# EasyEDA Pro project DS3 CONTROLLER R.epro

# Schematic Schematic1
Create Date: 2026-04-04; Page Name: P1; Project Name: DSBOARD3; Schematic Name: Schematic1; Update Date: 2026-04-05; Company: EasyEDA.com; Page Size: A4; Version: V1.0
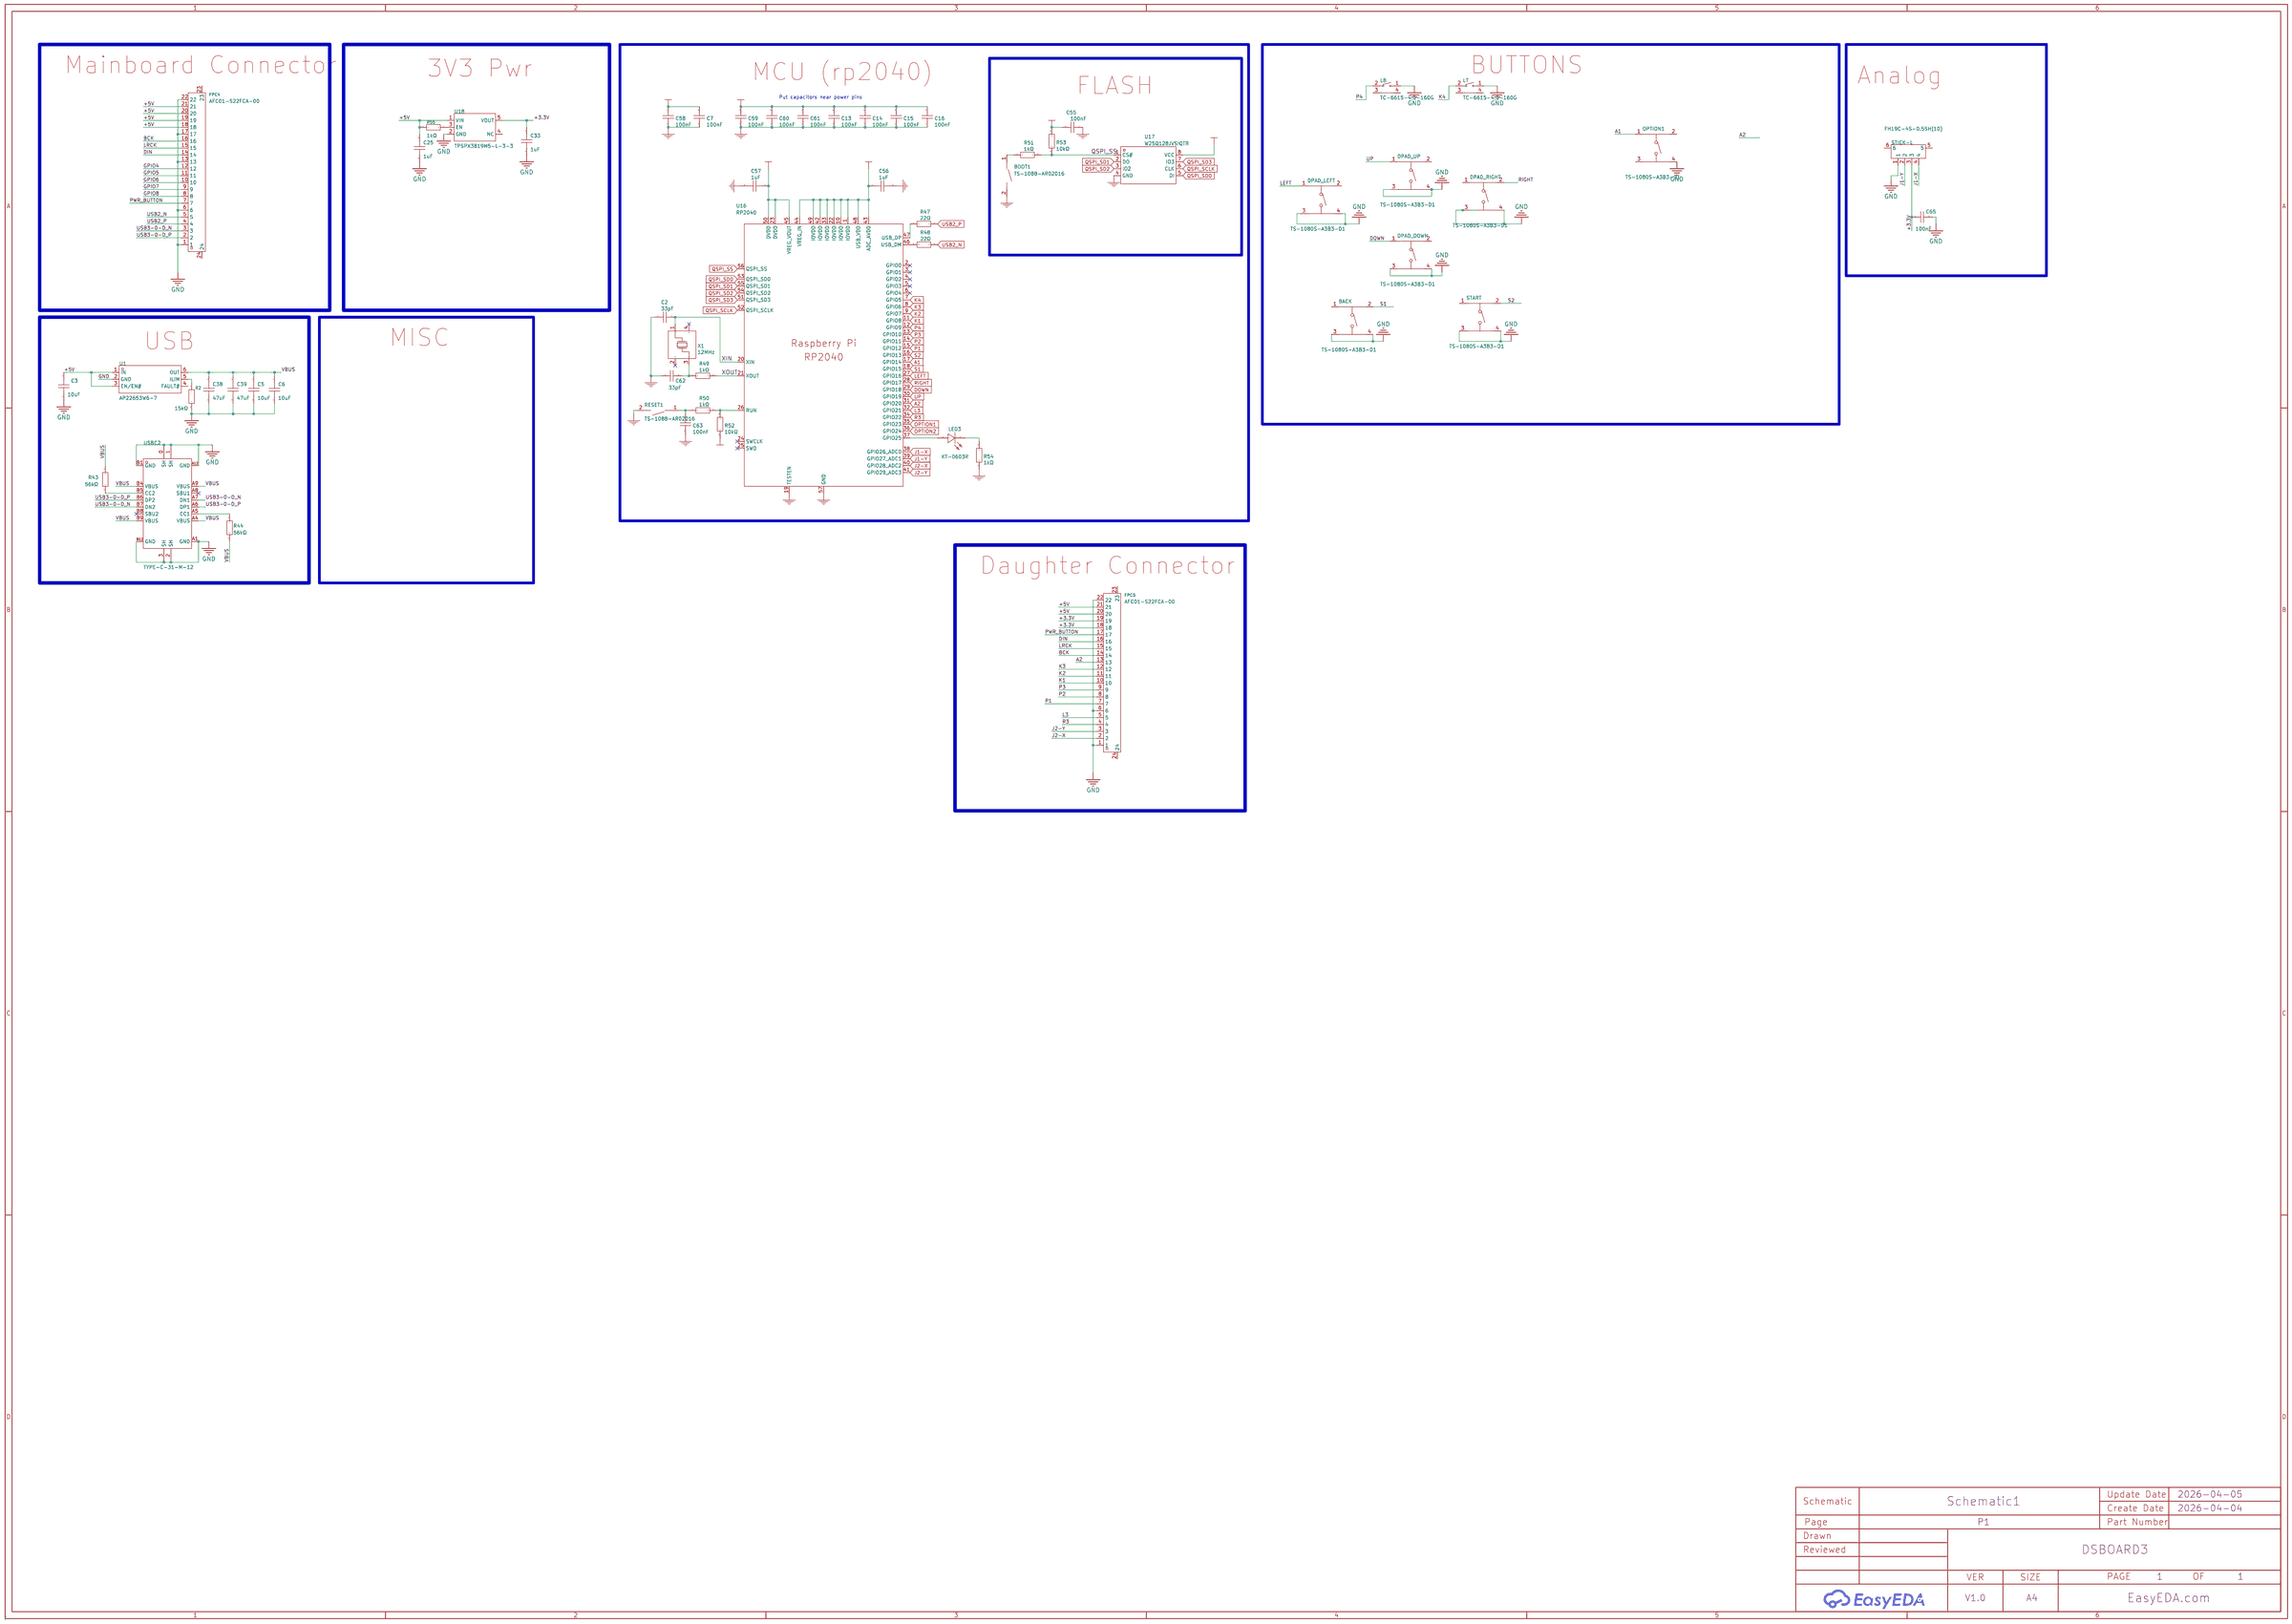
[diagram p0: schematic sheet]

## Parts
BACK  TS-1080S-A3B3-D1  [KEY-SMD_4P-L6.4-W6.0-P4.50-LS8.4]
BOOT1  TS-1088-AR02016  [SW-SMD_L3.9-W3.0-P4.45]
C2  33pF  [C0402]
C3  10uF  [C0805]
C5  10uF  [C0805]
C6  10uF  [C0805]
C7  100nF  [C0402]
C13  100nF  [C0402]
C14  100nF  [C0402]
C15  100nF  [C0402]
C16  100nF  [C0402]
C25  1uF  [C0603]
C33  1uF  [C0603]
C38  47uF  [C1206]
C39  47uF  [C1206]
C55  100nF  [C0402]
C56  1uF  [C0402]
C57  1uF  [C0402]
C58  100nF  [C0402]
C59  100nF  [C0402]
C60  100nF  [C0402]
C61  100nF  [C0402]
C62  33pF  [C0402]
C63  100nF  [C0402]
C65  100nF  [c0402]
DPAD_DOWN  TS-1080S-A3B3-D1  [KEY-SMD_4P-L6.4-W6.0-P4.50-LS8.4]
DPAD_LEFT  TS-1080S-A3B3-D1  [KEY-SMD_4P-L6.4-W6.0-P4.50-LS8.4]
DPAD_RIGHT  TS-1080S-A3B3-D1  [KEY-SMD_4P-L6.4-W6.0-P4.50-LS8.4]
DPAD_UP  TS-1080S-A3B3-D1  [KEY-SMD_4P-L6.4-W6.0-P4.50-LS8.4]
FPC4  AFC01-S22FCA-00  [FPC-SMD_P0.5-22P_FGS-XJ-H2.0]
FPC5  AFC01-S22FCA-00  [FPC-SMD_P0.5-22P_FGS-XJ-H2.0]
LB  TC-6615-4.5-160G  [KEY-TH_TC-6615-4.5-160G]
LED3  KT-0603R  [LED0603-RD]
LT  TC-6615-4.5-160G  [KEY-TH_TC-6615-4.5-160G]
OPTION1  TS-1080S-A3B3-D1  [KEY-SMD_4P-L6.4-W6.0-P4.50-LS8.4]
R2  15kΩ  [R0402]
R43  56kΩ  [R0402]
R44  56kΩ  [R0402]
R47  22Ω  [R0402]
R48  22Ω  [R0402]
R49  1kΩ  [R0402]
R50  1kΩ  [R0402]
R51  1kΩ  [R0402]
R52  10kΩ  [R0402]
R53  10kΩ  [R0402]
R54  1kΩ  [R0402]
R55  1kΩ  [R0402]
RESET1  TS-1088-AR02016  [SW-SMD_L3.9-W3.0-P4.45]
START  TS-1080S-A3B3-D1  [KEY-SMD_4P-L6.4-W6.0-P4.50-LS8.4]
STICK-L  FH19C-4S-0.5SH(10)  [FPC-SMD_FH19C-4S-0.5SH]
U1  AP22653W6-7  [SOT-23-6_L2.9-W1.6-P0.95-LS2.8-BR]
U16  RP2040  [LQFN-56_L7.0-W7.0-P0.4-EP]
U17  W25Q128JVSIQTR  [SOIC-8_L5.3-W5.3-P1.27-LS8.0-BL]
U18  TPSPX3819M5-L-3-3  [SOT-23-5_L3.0-W1.6-P0.95-LS2.8-BR]
USBC2  TYPE-C-31-M-12  [USB-C_SMD-TYPE-C-31-M-12]
X1  12MHz  [OSC-SMD_4P-L3.2-W2.5-BL]

## Library data of the parts
BACK DPAD_DOWN DPAD_LEFT DPAD_RIGHT DPAD_UP OPTION1 START = TS-1080S-A3B3-D1: Circuit:SPST Actuator Style:Round Button Operating Force:250gf Mounting Type:Standing paste Length:6.4mm Width:6mm Switch Height:3.1mm With Lamp:- Life:-; LCSC Part Name: 停产 6.4*6*3.1mm 立贴 轻触开关; Supplier Part: C499295; Manufacturer: Yuandi(元迪); Supplier Footprint: SMD,6.2x6.2mm; JLCPCB Part Class: Extended Part; Datasheet: https://atta.szlcsc.com/upload/public/pdf/source/20200318/C499299_4F5ACF0CDEE8DE9CCEB2FD2261C6EB2B.pdf; Supplier: LCSC; Circuit: SPST; Actuator Style: Round Button; Operating Force: 250gf; Mounting Type: Standing paste; Length: 6.4mm; Width: 6mm; Switch Height: 3.1mm; Mounting Style: Brick nogging; Switch Length: 6mm; Switch Width: 6mm; Contact Current: 50mA; Voltage Rating (DC): 12V; Insulation Resistance: 100MΩ; Mechanical Life: 10万次; Operating Temperature: -25℃~+85℃
BOOT1 RESET1 = TS-1088-AR02016: Circuit:SPST Actuator Style:Round Button Operating Force:160gf Mounting Style:Brick nogging Switch Length:4mm Switch Width:3mm Switch Height:2mm Strike Gundam:不带 Contact Current:50mA Voltage Rating (DC):12V Insulation Resistance:100MΩ Actuator/Cap Color:B; LCSC Part Name: 4*3*2mm 立贴 轻触开关; Supplier Part: C720477; Manufacturer: XUNPU(讯普); Supplier Footprint: SMD; JLCPCB Part Class: Basic Part; Datasheet: https://atta.szlcsc.com/upload/public/pdf/source/20200810/C720475_60D09DD6C54279ADDB2DC25100F1CC11.pdf; Supplier: LCSC; Circuit: SPST; Actuator Style: Round Button; Operating Force: 160gf; Mounting Style: Brick nogging; Switch Length: 4mm; Switch Width: 3mm; Switch Height: 2mm; Strike Gundam: 不带; Contact Current: 50mA; Voltage Rating (DC): 12V; Insulation Resistance: 100MΩ; Actuator/Cap Color: Black; Pin Style: SMDSplicing; Mechanical Life: 10万次; Operating Temperature: -30℃~+80℃
C2 C62 = 0402CG330J500NT: Supplier: LCSC; Manufacturer: FH(风华); Supplier Part: C1562; JLCPCB Part Class: Basic Part
C3 C5 C6 = CL21A106KAYNNNE_C15850: Capacitance: Tolerance:±10% Tolerance:±10% Voltage Rated: Temperature Coefficient:; LCSC Part Name: 10uF ±10% 25V; Supplier Part: C15850; Manufacturer: SAMSUNG(三星); Manufacturer Part: CL21A106KAYNNNE; Supplier Footprint: 0805; JLCPCB Part Class: Basic Part; Datasheet: https://atta.szlcsc.com/upload/public/pdf/source/20160218/1457707763339.pdf; Supplier: LCSC; Tolerance: ±10%
C7 C13-C16 C55 C58-C61 C63 C65 = CL05B104KO5NNNC: Supplier: LCSC; Manufacturer: SAMSUNG(三星); Supplier Part: C1525; JLCPCB Part Class: Basic Part
C25 C33 = CL10A105KB8NNNC: Capacitance: Tolerance:±10% Tolerance:±10% Voltage Rated: Temperature Coefficient:; LCSC Part Name: 1uF ±10% 50V; Supplier Part: C15849; Manufacturer: SAMSUNG(三星); Supplier Footprint: 0603; JLCPCB Part Class: Basic Part; Datasheet: https://atta.szlcsc.com/upload/public/pdf/source/20160218/1457707763339.pdf; Supplier: LCSC; Tolerance: ±10%
C38 C39 = CL31A476MPHNNNE: Capacitance: Tolerance:±20% Tolerance:±20% Voltage Rated: Temperature Coefficient:; LCSC Part Name: 47uF ±20% 10V; Supplier Part: C96123; Manufacturer: SAMSUNG(三星); Supplier Footprint: 1206; JLCPCB Part Class: Basic Part; Datasheet: https://atta.szlcsc.com/upload/public/pdf/source/20160218/1457707763339.pdf; Supplier: LCSC; Tolerance: ±20%
C56 C57 = CL05A105KA5NQNC: Supplier: LCSC; Manufacturer: SAMSUNG(三星); Supplier Part: C52923; JLCPCB Part Class: Basic Part
FPC4 FPC5 = AFC01-S22FCA-00: Locking Feature:Clamshell Contact Type:Bottom Contact Number of Contacts:22P Pitch:0.5mm Mounting Type:卧贴 FFC, FCB Thickness:0.3mm FFC, FCB Thickness:0.3mm Height Above Board:2mm; LCSC Part Name: 间距:0.5mm P数:22P 翻盖式 下接; Supplier Part: C262668; Manufacturer: JS(钜硕电子); Supplier Footprint: SMD,P=0.5mm,卧贴; JLCPCB Part Class: Extended Part; Datasheet: https://atta.szlcsc.com/upload/public/pdf/source/20190816/C413942_2A72D1AC756EAE17EEDF756A339D4500.pdf; Supplier: LCSC; Locking Feature: Clamshell; Contact Type: Bottom Contact; Number of Contacts: 22P; Pitch: 0.5mm; Mounting Type: 卧贴; FFC, FCB Thickness: 0.3mm; Height Above Board: 2mm; Contact Material: Phosphor bronze; Contact Plating: Gold; Operating Temperature Range: -40℃~+85℃
LB LT = TC-6615-4.5-160G: Circuit:SPST Actuator Style:Round Button Operating Force:160gf Mounting Style:Horizontal Plug Switch Length:6mm Switch Width:6mm Switch Height:4.5mm Strike Gundam:With bracket Contact Current:50mA Voltage Rating (AC):- Voltage Rating (DC):12V Insulation R; LCSC Part Name: 6*6*4.5mm 卧插 轻触开关; Supplier Part: C6575012; Manufacturer: HCTL(华灿天禄); Supplier Footprint: 插件; JLCPCB Part Class: Extended Part; Datasheet: https://atta.szlcsc.com/upload/public/pdf/source/20230523/20C79B748B4ACB531A66068A8A6BD305.pdf; Supplier: LCSC; Circuit: SPST; Actuator Style: Round Button; Operating Force: 160gf; Mounting Style: Horizontal Plug; Switch Length: 6mm; Switch Width: 6mm; Switch Height: 4.5mm; Strike Gundam: With bracket; Contact Current: 50mA; Voltage Rating (DC): 12V; Insulation Resistance: 100MΩ; Actuator/Cap Color: Black; With Lamp: None; Mechanical Life: 100000 Times; Operating Temperature: -25℃~+85℃
LED3 = KT-0603R: Emitted Color:Red Power Dissipation:- Forward Current:- Dominant Wavelength:- Dominant Wavelength:- Peak Wavelength:- Diode Configuration:- Lens Color:- Color Temperature:- Color Temperature:- Viewing Angle:- Mounting Sytle:- Operating Temperature:-40℃~+8; LCSC Part Name: 0603 红灯 高亮; Supplier Part: C2286; Manufacturer: KENTO; Supplier Footprint: 0603; JLCPCB Part Class: Basic Part; Datasheet: https://atta.szlcsc.com/upload/public/pdf/source/20160616/1466072038404.pdf; Supplier: LCSC; Emitted Color: Red; Operating Temperature: -40℃~+85℃
R2 = 0402WGF1502TCE: Type:Thick Film Resistors Resistance:15kΩ Tolerance:±1% Tolerance:±1% Power(Watts): Overload Voltage (Max): Temperature Coefficient:±100ppm/℃ Temperature Coefficient:±100ppm/℃ Operating Temperature Range:-55℃~+155℃ Operating Temperature Range:-55℃~+155℃; LCSC Part Name: 15kΩ ±1% 62.5mW 厚膜电阻; Supplier Part: C25756; Manufacturer: UNI-ROYAL(厚声); Supplier Footprint: 0402; JLCPCB Part Class: Basic Part; Datasheet: https://atta.szlcsc.com/upload/public/pdf/source/20200306/C422600_1E6D84923E4A46A82E41ADD87F860B5C.pdf; Supplier: LCSC; Type: Thick Film Resistors; Tolerance: ±1%; Temperature Coefficient: ±100ppm/℃; Operating Temperature Range: -55℃~+155℃
R43 R44 = 0402WGF5602TCE: Type:Thick Film Resistors Resistance:56kΩ Tolerance:±1% Tolerance:±1% Power(Watts): Overload Voltage (Max): Temperature Coefficient:±100ppm/℃ Temperature Coefficient:±100ppm/℃ Operating Temperature Range:-55℃~+155℃ Operating Temperature Range:-55℃~+155℃; LCSC Part Name: 56kΩ ±1% 62.5mW 厚膜电阻; Supplier Part: C25796; Manufacturer: UNI-ROYAL(厚声); Supplier Footprint: 0402; JLCPCB Part Class: Extended Part; Datasheet: https://atta.szlcsc.com/upload/public/pdf/source/20200306/C422600_1E6D84923E4A46A82E41ADD87F860B5C.pdf; Supplier: LCSC; Type: Thick Film Resistors; Tolerance: ±1%; Temperature Coefficient: ±100ppm/℃; Operating Temperature Range: -55℃~+155℃
R47 R48 = 0402WGF220JTCE: Supplier: LCSC; Manufacturer: UNI-ROYAL(厚声); Supplier Part: C25092; Resistance: 22; JLCPCB Part Class: Basic Part
R49-R51 R54 = 0402WGF1001TCE: Supplier: LCSC; Manufacturer: UNI-ROYAL(厚声); Supplier Part: C11702; Resistance: 1K; JLCPCB Part Class: Basic Part
R52 R53 = 0402WGF1002TCE: Supplier: LCSC; Manufacturer: UNI-ROYAL(厚声); Supplier Part: C25744; Resistance: 10K; JLCPCB Part Class: Basic Part
R55 = 0402WGF1001TCE: Type:Thick Film Resistors Resistance:1kΩ Tolerance:±1% Tolerance:±1% Power(Watts): Overload Voltage (Max): Temperature Coefficient:±100ppm/℃ Temperature Coefficient:±100ppm/℃ Operating Temperature Range:-55℃~+155℃ Operating Temperature Range:-55℃~+155℃; LCSC Part Name: 1kΩ ±1% 62.5mW 厚膜电阻; Supplier Part: C11702; Manufacturer: UNI-ROYAL(厚声); Supplier Footprint: 0402; JLCPCB Part Class: Basic Part; Datasheet: https://atta.szlcsc.com/upload/public/pdf/source/20200306/C422600_1E6D84923E4A46A82E41ADD87F860B5C.pdf; Supplier: LCSC; Type: Thick Film Resistors; Tolerance: ±1%; Temperature Coefficient: ±100ppm/℃; Operating Temperature Range: -55℃~+155℃
STICK-L = FH19C-4S-0.5SH(10): Locking Feature:Clamshell Contact Type:Bottom Contact Number of Contacts:4P Pitch:0.5mm Mounting Type:卧贴 FFC, FCB Thickness:0.2mm FFC, FCB Thickness:0.2mm Height Above Board:0.88mm Contact Material:Phosphor bronze Contact Plating:Gold Operating Temperatur; LCSC Part Name: 间距:0.5mm P数:4P 翻盖式 下接; Supplier Part: C424650; Manufacturer: HRS(广濑); Supplier Footprint: SMD,P=0.5mm,卧贴; JLCPCB Part Class: Extended Part; Datasheet: https://atta.szlcsc.com/upload/public/pdf/source/20190903/C424652_96088C35DDF9B9746B51C85A1732CDEC.pdf; Supplier: LCSC; Locking Feature: Clamshell; Contact Type: Bottom Contact; Number of Contacts: 4P; Pitch: 0.5mm; Mounting Type: 卧贴; FFC, FCB Thickness: 0.2mm; Height Above Board: 0.88mm; Contact Material: Phosphor bronze; Contact Plating: Gold; Operating Temperature Range: -55℃~+85℃
U1 = AP22653W6-7: Number of Outputs:1 Output Current:2.1A Input Voltage:3V~5.5V Input Voltage:3V~5.5V Resistor On-State:65mΩ Operating Temperature -:-40℃~+85℃ Operating Temperature -:-40℃~+85℃; Supplier Part: C2158037; Manufacturer: DIODES(美台); Supplier Footprint: SOT-26; JLCPCB Part Class: Extended Part; Datasheet: https://atta.szlcsc.com/upload/public/pdf/source/20210630/864BBA6F47FEA2EACA8A2C6E64AF9219.pdf; Supplier: LCSC; Number of Outputs: 1; Output Current: 2.1A; Input Voltage: 3V~5.5V; Resistor On-State: 65mΩ; Operating Temperature	-: -40℃~+85℃
U16 = RP2040: Supplier: LCSC; Supplier Part: C2040; Manufacturer: Raspberry Pi(树莓派); JLCPCB Part Class: Extended Part
U17 = W25Q128JVSIQ: Supplier: LCSC; Manufacturer: WINBOND(华邦); Supplier Part: C97521; JLCPCB Part Class: Basic Part
U18 = TPSPX3819M5-L-3-3: Output Type:Fixed Voltage - Supply:20V Output Voltage:3.3V Output Voltage:3.3V Output Current:500mA Power Supply Rejection Ratio (PSRR):- Operating Temperature:-40℃~+125℃@(Tj) Operating Temperature:-40℃~+125℃@(Tj) Output Configuration:Positive electrode N; Supplier Part: C5370980; Manufacturer: TECH PUBLIC(台舟); Supplier Footprint: SOT-23-5; JLCPCB Part Class: Extended Part; Datasheet: https://atta.szlcsc.com/upload/public/pdf/source/20231102/1CEED3DA25748E8590103A514E6172D9.pdf; Supplier: LCSC; Output Type: Fixed; Voltage - Supply: 20V; Output Voltage: 3.3V; Output Current: 500mA; Operating Temperature: -40℃~+125℃@(Tj); Output Configuration: Positive electrode; Number of Outputs: 1
USBC2 = TYPE-C-31-M-12: Connector Type:Type-C Standard:- Gender:Female Mounting Style:- Number of Contacts:16P Number of Ports:1 Current Rating - Power (Max):5A Operating Temperature Range:- Operating Temperature Range:-; LCSC Part Name: Type-C 母; Supplier Part: C165948; Manufacturer: 韩国韩荣; Supplier Footprint: SMD; JLCPCB Part Class: Extended Part; Datasheet: https://atta.szlcsc.com/upload/public/pdf/source/20220525/466408E853115E789EDB0DDC29077C05.pdf; Supplier: LCSC; Connector Type: Type-C; Gender: Female; Number of Contacts: 16P; Number of Ports: 1; Current Rating - Power (Max): 5A
X1 = X322512MSB4SI: Supplier: LCSC; Manufacturer: YXC; Supplier Part: C9002; JLCPCB Part Class: Basic Part

## Nets
+1V1: C7.2 C57.1 C58.2 U16.23(DVDD) U16.45(VREG_VOUT) U16.50(DVDD)
+3.3V: C13.2 C14.2 C15.2 C16.2 C33.1 C55.2 C56.1 C59.2 C60.2 C61.2 C65.1 FPC5.18 FPC5.19 R52.1 R53.2 STICK-L.3 U16.1(IOVDD) U16.10(IOVDD) U16.22(IOVDD) U16.33(IOVDD) U16.42(IOVDD) U16.43(ADC_AVDD) U16.44(VREG_IN) U16.48(USB_VDD) U16.49(IOVDD) U17.8(VCC) U18.5(VOUT)
+5V: C3.1 C25.1 FPC4.18 FPC4.19 FPC4.20 FPC4.21 FPC5.20 FPC5.21 R55.1 U1.1(IN) U1.3(EN/EN#) U18.1(VIN)
GND: BACK.3 BACK.4 BOOT1.2 C2.1 C3.2 C5.2 C6.2 C7.1 C13.1 C14.1 C15.1 C16.1 C25.2 C33.2 C38.2 C39.2 C55.1 C56.2 C57.2 C58.1 C59.1 C60.1 C61.1 C62.1 C63.1 C65.2 DPAD_DOWN.3 DPAD_DOWN.4 DPAD_LEFT.3 DPAD_LEFT.4 DPAD_RIGHT.3 DPAD_RIGHT.4 DPAD_UP.3 DPAD_UP.4 FPC4.1 FPC4.6 FPC4.13 FPC4.17 FPC4.22 FPC5.1 FPC5.6 FPC5.22 LB.1 LT.1 OPTION1.4 R2.2 R54.1 RESET1.2 START.3 START.4 STICK-L.1 U1.2(GND) U16.19(TESTEN) U16.57(GND) U17.4(GND) U18.2(GND) USBC2.0(SH) USBC2.1(SH) USBC2.2(SH) USBC2.3(SH) USBC2.A1(GND) USBC2.A12(GND) USBC2.B1(GND) USBC2.B12(GND)
VBUS: C5.1 C6.1 C38.1 C39.1 R43.2 R44.2 U1.6(OUT) USBC2.A4(VBUS) USBC2.A9(VBUS) USBC2.B4(VBUS) USBC2.B9(VBUS)
A1: OPTION1.1 U16.17(GPIO14)
A2: FPC5.13 U16.31(GPIO20)
BCK: FPC4.16 FPC5.14
DIN: FPC4.14 FPC5.16
DOWN: DPAD_DOWN.1 U16.29(GPIO18)
GPIO4: FPC4.12
GPIO5: FPC4.11
GPIO6: FPC4.10
GPIO7: FPC4.9
GPIO8: FPC4.8
J1-X: STICK-L.4 U16.38(GPIO26_ADC0)
J1-Y: STICK-L.2 U16.39(GPIO27_ADC1)
J2-X: FPC5.2 U16.40(GPIO28_ADC2)
J2-Y: FPC5.3 U16.41(GPIO29_ADC3)
K1: FPC5.10 U16.11(GPIO8)
K2: FPC5.11 U16.9(GPIO7)
K3: FPC5.12 U16.8(GPIO6)
K4: LT.2 U16.7(GPIO5)
L3: FPC5.5 U16.32(GPIO21)
LEFT: DPAD_LEFT.1 U16.27(GPIO16)
LRCK: FPC4.15 FPC5.15
OPTION1: U16.35(GPIO23)
OPTION2: U16.36(GPIO24)
P1: FPC5.7 U16.15(GPIO12)
P2: FPC5.8 U16.14(GPIO11)
P3: FPC5.9 U16.13(GPIO10)
P4: LB.2 U16.12(GPIO9)
PWR_BUTTON: FPC4.7 FPC5.17
QSPI_SCLK: U16.52(QSPI_SCLK) U17.6(CLK)
QSPI_SD0: U16.53(QSPI_SD0) U17.5(DI)
QSPI_SD1: U16.55(QSPI_SD1) U17.2(DO)
QSPI_SD2: U16.54(QSPI_SD2) U17.3(IO2)
QSPI_SD3: U16.51(QSPI_SD3) U17.7(IO3)
QSPI_SS: R51.2 R53.1 U16.56(QSPI_SS) U17.1(CS#)
R3: FPC5.4 U16.34(GPIO22)
RIGHT: DPAD_RIGHT.2 U16.28(GPIO17)
S1: BACK.2 U16.18(GPIO15)
S2: START.2 U16.16(GPIO13)
UP: DPAD_UP.1 U16.30(GPIO19)
USB2_N: FPC4.5 R48.2
USB2_P: FPC4.4 R47.1
USB3-0-D_N: FPC4.3 USBC2.A7(DN1) USBC2.B7(DN2)
USB3-0-D_P: FPC4.2 USBC2.A6(DP1) USBC2.B6(DP2)
XIN: C2.2 U16.20(XIN) X1.1(OSC1)
XOUT: R49.2 U16.21(XOUT)
$1N5125: R43.1 USBC2.B5(CC2)
$1N5126: R44.1 USBC2.A5(CC1)
$1N5147: R2.1 U1.5(ILIM)
$1N5203: LED3.1(K) R54.2
$1N5210: C62.2 R49.1 X1.3(OSC2)
$1N5217: BOOT1.1 R51.1
$1N5218: R50.2 R52.2 U16.26(RUN)
$1N5219: LED3.2(A) U16.37(GPIO25)
$1N5220: R47.2 U16.47(USB_DP)
$1N5221: C63.2 R50.1 RESET1.1
$1N5239: R48.1 U16.46(USB_DM)
$1N5319: R55.2 U18.3(EN)

Not connected (* = marked no-connect by the designer): BACK 1; DPAD_DOWN 2; DPAD_LEFT 2; DPAD_RIGHT 1; DPAD_UP 2; FPC4 23 24; FPC5 23 24; LB 3 4; LT 3 4; OPTION1 2 3; START 1; STICK-L 5 6; U1 4(FAULT#); U16 2(GPIO0)* 3(GPIO1)* 4(GPIO2)* 5(GPIO3)* 6(GPIO4)* 24(SWCLK)* 25(SWD)*; U18 4(NC); USBC2 A8(SBU1)* B8(SBU2)*; X1 2(GND)* 4(GND)*

## Notes on the sheet
- Mainboard Connector
- 3V3 Pwr
- BUTTONS
- MCU (rp2040)
- Analog
- FLASH
- Put capacitors near power pins
- MISC
- USB
- Daughter Connector

# Board PCB1
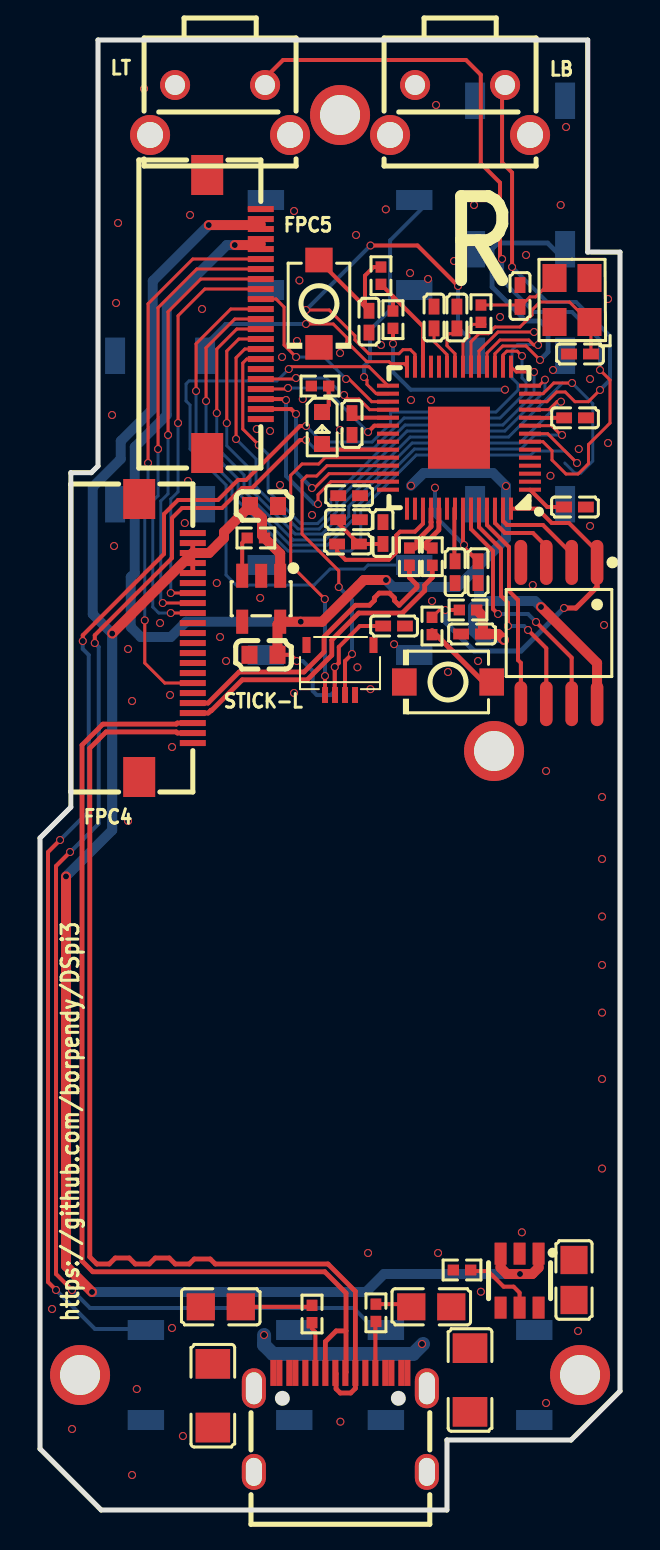
[diagram p1: board, top side]
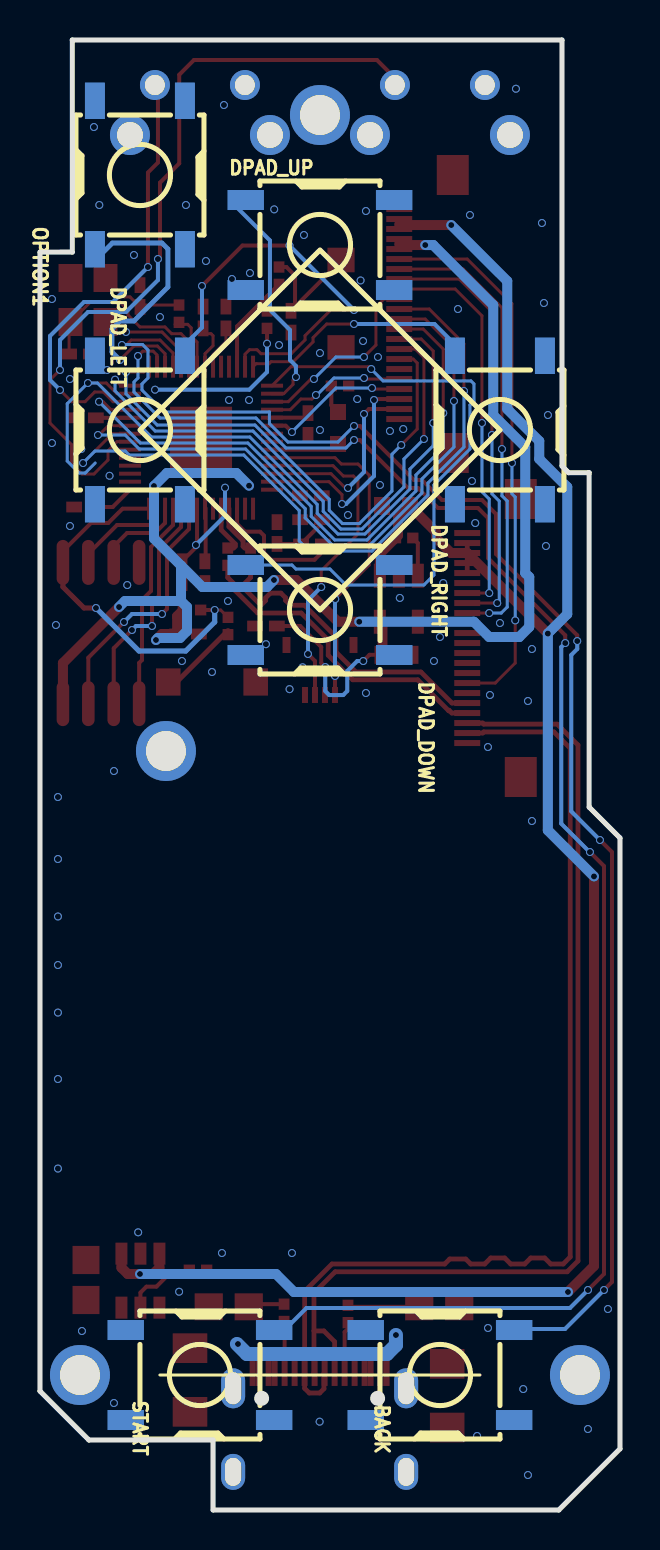
[diagram p2: board, bottom side, seen from below]

Outline 29 x 73.5 mm; copper layers: Top Layer, Inner1, Inner2, Bottom Layer. Coordinates in mm from the lower left corner of the outline.
Outline path: 0,33.6 0,3.06 3.06,0 20.35,0 20.35,3.5 26.55,3.5 29,5.95 29,62.89 27.38,62.9 27.38,73.5 2.9,73.5 2.9,52.2 2.57,51.87 1.54,51.87 1.54,35.14 0,33.6
Stack: Top Layer 0.035mm 外层铜厚1oz / Dielectric1 0.2104mm 7628 RC49% 8.6mil / Inner1 0.0152mm 内层铜厚 / Dielectric2 1.065mm 1.1mm H/HOZ 含铜 / Inner2 0.0152mm 内层铜厚 / Dielectric3 0.2104mm 7628 RC49% 8.6mil / Bottom Layer 0.035mm 外层铜厚1oz

## Design rules (mm)
net USB3-0-D_N: usb2-2
net USB3-0-D_P: usb2-2
net $1N5239: DP1
net $1N5220: DP1
net USB2_P: USB2
net USB2_N: USB2
template: Custom Config
spacing copperThickness1oz (default): track to track 0.102, other pairs 0.152 to 0.3
spacing copperThickness2oz: track to track 0.203, other pairs 0.152 to 0.3
track width copperThickness1oz (default): min 0.127, default 0.254, max 2.54
track width copperThickness2oz: min 0.203, default 0.254, max 2.54
differential pair differentialPair (default): width min 0.127, default 0.254, max 2.54; gap min 0.152, default 0.152
differential pair USB2: width min 0.239, default 0.239, max 0.239; gap min 0.15, default 0.15
via viaSize (default): diameter min 0.3, default 0.61, max 10; hole min 0.2, default 0.305, max 6.3
net USB3-0-D_N uses USB2
net USB3-0-D_P uses USB2
net $1N5239 uses USB2
net $1N5220 uses USB2
net USB2_P uses USB2
net USB2_N uses USB2
diff pair usb2-2 uses USB2
diff pair DP1 uses USB2
diff pair USB2 uses USB2
pour e541 uses copperRegion1
pour e557 uses copperRegion1
pour e573 uses copperRegion1
pour e584 uses copperRegion1
pour e1789 uses copperRegion1
pour e1821 uses copperRegion1
pour e544 uses copperRegion1
pour e319 uses copperRegion1
pour e524 uses copperRegion1
pour e640 uses copperRegion1
pour e669 uses copperRegion1

## Placement (name value [footprint] x y rotation side)
BACK  TS-1080S-A3B3-D1  [KEY-SMD_4P-L6.4-W6.0-P4.50-LS8.4]  9 6.75 180 bottom
BOOT1  TS-1088-AR02016  [SW-SMD_L3.9-W3.0-P4.45]  20.4 41.4 180 top
C2  33pF  [C0402]  27 57.8 0 top
C3  10uF  [C0805]  26.7 11.5 270 top
C5  10uF  [C0805]  9.04 10.16 180 top
C6  10uF  [C0805]  19.56 10.16 0 top
C7  100nF  [C0402]  15.4 48.3 180 top
C13  100nF  [C0402]  20.84 59.62 270 top
C14  100nF  [C0402]  17.15 48.85 90 top
C15  100nF  [C0402]  15.46 50.72 0 top
C16  100nF  [C0402]  15.6 54.3 90 top
C25  1uF  [C0603]  11.2 50.2 0 top
C33  1uF  [C0603]  11.17 42.76 180 top
C38  47uF  [C1206]  21.5 6.5 270 top
C39  47uF  [C1206]  8.64 5.71 270 top
C55  100nF  [C0402]  21.6 43.8 0 top
C56  1uF  [C0402]  15.45 49.52 180 top
C57  1uF  [C0402]  19.7 59.62 90 top
C58  100nF  [C0402]  21.9 46.89 90 top
C59  100nF  [C0402]  20.76 46.89 90 top
C60  100nF  [C0402]  26.75 50.15 180 top
C61  100nF  [C0402]  26.75 54.61 180 top
C62  33pF  [C0402]  24 60.7 270 top
C63  100nF  [C0402]  16.45 59.42 90 top
C65  100nF  [c0402]  17.7 44.2 0 top
DPAD_DOWN  TS-1080S-A3B3-D1  [KEY-SMD_4P-L6.4-W6.0-P4.50-LS8.4]  15 45 180 bottom
DPAD_LEFT  TS-1080S-A3B3-D1  [KEY-SMD_4P-L6.4-W6.0-P4.50-LS8.4]  24 54 270 bottom
DPAD_RIGHT  TS-1080S-A3B3-D1  [KEY-SMD_4P-L6.4-W6.0-P4.50-LS8.4]  6 54 90 bottom
DPAD_UP  TS-1080S-A3B3-D1  [KEY-SMD_4P-L6.4-W6.0-P4.50-LS8.4]  15 63.25 180 bottom
FPC4  AFC01-S22FCA-00  [FPC-SMD_P0.5-22P_FGS-XJ-H2.0]  6.3 43.6 90 top
FPC5  AFC01-S22FCA-00  [FPC-SMD_P0.5-22P_FGS-XJ-H2.0]  9.7 59.8 90 top
LB  TC-6615-4.5-160G  [KEY-TH_TC-6615-4.5-160G]  21 70 180 top
LED3  KT-0603R  [LED0603-RD]  14.1 54.1 270 top
LT  TC-6615-4.5-160G  [KEY-TH_TC-6615-4.5-160G]  9 70 180 top
NOREF  -  [Pad_e1630]  15 69.75 0 top
NOREF#2  -  [Pad_e0]  27 6.75 0 top
NOREF#3  -  [Pad_e1629]  22.7 37.95 0 top
NOREF#4  -  [Pad_e1627]  2 6.75 0 top
OPTION1  TS-1080S-A3B3-D1  [KEY-SMD_4P-L6.4-W6.0-P4.50-LS8.4]  24 66.75 90 bottom
R2  15kΩ  [R0402]  21.1 12 180 top
R43  56kΩ  [R0402]  16.8 9.86 90 top
R44  56kΩ  [R0402]  13.6 9.8 90 top
R47  22Ω  [R0402]  19.61 47.67 90 top
R48  22Ω  [R0402]  18.47 47.67 270 top
R49  1kΩ  [R0402]  22.05 59.81 270 top
R50  1kΩ  [R0402]  17.05 61.72 270 top
R51  1kΩ  [R0402]  19.6 44.2 90 top
R52  10kΩ  [R0402]  17.65 59.52 90 top
R53  10kΩ  [R0402]  21.4 45 0 top
R54  1kΩ  [R0402]  14 56.2 0 top
R55  1kΩ  [R0402]  10.79 48.6 180 top
RESET1  TS-1088-AR02016  [SW-SMD_L3.9-W3.0-P4.45]  13.95 60.31 270 top
START  TS-1080S-A3B3-D1  [KEY-SMD_4P-L6.4-W6.0-P4.50-LS8.4]  21 6.75 180 bottom
STICK-L  FH19C-4S-0.5SH(10)  [FPC-SMD_FH19C-4S-0.5SH]  15 42 180 top
U1  AP22653W6-7  [SOT-23-6_L2.9-W1.6-P0.95-LS2.8-BR]  23.98 11.47 90 top
U16  RP2040  [LQFN-56_L7.0-W7.0-P0.4-EP]  20.95 53.62 180 top
U17  W25Q128JVSIQTR  [SOIC-8_L5.3-W5.3-P1.27-LS8.0-BL]  25.95 43.85 180 top
U18  TPSPX3819M5-L-3-3  [SOT-23-5_L3.0-W1.6-P0.95-LS2.8-BR]  11.06 45.56 90 top
USBC2  TYPE-C-31-M-12  [USB-C_SMD-TYPE-C-31-M-12]  15.02 4.38 0 top
X1  12MHz  [OSC-SMD_4P-L3.2-W2.5-BL]  26.6 60.5 90 top

## Footprints (pads in the part's own frame, mm; a bottom-side part is the same pattern mirrored in y, then rotated)
C0402
  rect 0.79x0.54 smd: 1(-0.545,0) 2(0.545,0)
c0402
  rect 0.79x0.54 smd: 1(-0.545,0) 2(0.545,0)
C0603
  rect 0.8x0.9 smd: 1(-0.7,0) 2(0.7,0)
C0805
  rect 1.41x1.35 smd: 1(-1,0) 2(1,0)
C1206
  rect 1.485x1.728 smd: 1(-1.593,0) 2(1.593,0)
FPC-SMD_FH19C-4S-0.5SH
  rect 0.3x0.8 smd: 1(-0.75,1.25) 2(-0.25,1.25) 3(0.25,1.25) 4(0.75,1.25)
  rect 0.4x0.8 smd: 5(1.675,-1.25) 6(-1.675,-1.25)
FPC-SMD_P0.5-22P_FGS-XJ-H2.0
  rect 0.3x1.3 smd: 1(-5.252,-1.338) 2(-4.752,-1.338) 3(-4.252,-1.338) 4(-3.752,-1.338) 5(-3.252,-1.338) 6(-2.752,-1.338) 7(-2.252,-1.338) 8(-1.752,-1.338) 9(-1.25,-1.339) 10(-0.752,-1.338) 11(-0.252,-1.338) 12(0.248,-1.338) 13(0.748,-1.338) 14(1.248,-1.338) 15(1.748,-1.338) 16(2.248,-1.338) 17(2.748,-1.338) 18(3.248,-1.338) 19(3.748,-1.338) 20(4.25,-1.339) 21(4.748,-1.338) 22(5.248,-1.338)
  rect 2x1.6 smd: 23(6.95,1.339) 24(-6.95,1.339)
KEY-SMD_4P-L6.4-W6.0-P4.50-LS8.4
  rect 1.82x1 smd: 1(-3.71,2.25) 2(3.71,2.25) 3(-3.71,-2.25) 4(3.71,-2.25)
KEY-TH_TC-6615-4.5-160G
  round 1.5 hole 1: 1(2.25,-1.25) 2(-2.25,-1.25)
  round 2 hole 1.3: 3(-3.5,1.25) 4(3.5,1.25)
LED0603-RD
  rect 0.8x0.8 smd: 1(-0.799,0) 2(0.799,0)
LQFN-56_L7.0-W7.0-P0.4-EP
  rect 1.1x0.2 smd: 1(-3.55,2.6) 2(-3.55,2.2) 3(-3.55,1.8) 4(-3.55,1.4) 5(-3.55,1) 6(-3.55,0.6) 7(-3.55,0.2) 8(-3.55,-0.2) 9(-3.55,-0.6) 10(-3.55,-1) 11(-3.55,-1.4) 12(-3.55,-1.8) 13(-3.55,-2.2) 14(-3.55,-2.6) 29(3.55,-2.6) 30(3.55,-2.2) 31(3.55,-1.8) 32(3.55,-1.4) 33(3.55,-1) 34(3.55,-0.6) 35(3.55,-0.2) 36(3.55,0.2) 37(3.55,0.6) 38(3.55,1) 39(3.55,1.4) 40(3.55,1.8) 41(3.55,2.2) 42(3.55,2.6)
  rect 0.2x1.1 smd: 15(-2.6,-3.55) 16(-2.2,-3.55) 17(-1.8,-3.55) 18(-1.4,-3.55) 19(-1,-3.55) 20(-0.6,-3.55) 21(-0.2,-3.55) 22(0.2,-3.55) 23(0.6,-3.55) 24(1,-3.55) 25(1.4,-3.55) 26(1.8,-3.55) 27(2.2,-3.55) 28(2.6,-3.55) 43(2.6,3.55) 44(2.2,3.55) 45(1.8,3.55) 46(1.4,3.55) 47(1,3.55) 48(0.6,3.55) 49(0.2,3.55) 50(-0.2,3.55) 51(-0.6,3.55) 52(-1,3.55) 53(-1.4,3.55) 54(-1.8,3.55) 55(-2.2,3.55) 56(-2.6,3.55)
  rect 3.1x3.1 smd: 57(0,0)
OSC-SMD_4P-L3.2-W2.5-BL
  rect 1.4x1.2 smd: 1(-1.1,-0.875) 2(1.1,-0.875) 3(1.1,0.875) 4(-1.1,0.875)
Pad_e0
  round 3 hole 2: 58(0,0)
Pad_e1627
  round 3 hole 2: 58(0,0)
Pad_e1629
  round 3 hole 2: 58(0,0)
Pad_e1630
  round 3 hole 2: 58(0,0)
R0402
  rect 0.566x0.54 smd: 1(-0.433,0) 2(0.433,0)
SOIC-8_L5.3-W5.3-P1.27-LS8.0-BL
  oval 0.63x2.25 smd: 1(-1.905,-3.53) 2(-0.635,-3.53) 3(0.635,-3.53) 4(1.905,-3.53) 5(1.905,3.53) 6(0.635,3.53) 7(-0.635,3.53) 8(-1.905,3.53)
SOT-23-5_L3.0-W1.6-P0.95-LS2.8-BR
  rect 1.2x0.6 smd: 1(1.15,-0.95) 2(1.15,0) 3(1.15,0.95) 4(-1.15,0.95) 5(-1.15,-0.95)
SOT-23-6_L2.9-W1.6-P0.95-LS2.8-BR
  rect 1.1x0.6 smd: 1(1.35,-0.95) 2(1.35,0) 3(1.35,0.95) 4(-1.35,0.95) 5(-1.35,0) 6(-1.35,-0.95)
SW-SMD_L3.9-W3.0-P4.45
  rect 1.23x1.36 smd: 1(-2.185,0) 2(2.185,0)
USB-C_SMD-TYPE-C-31-M-12
  oval 1.2x2 hole 0.8x1.6: 0(-4.325,1.706) 1(4.325,1.706)
  oval 1.2x1.8 hole 0.8x1.4: 2(4.325,-2.474) 3(-4.325,-2.474)
  rect 0.3x1.3 smd: A1(-3.35,2.474) A4(-2.55,2.474) A5(-1.25,2.474) A6(-0.25,2.474) A7(0.25,2.474) A8(1.25,2.474) A9(2.55,2.474) A12(3.35,2.474) B1(3.05,2.474) B4(2.25,2.474) B5(1.75,2.474) B6(0.75,2.474) B7(-0.75,2.474) B8(-1.75,2.474) B9(-2.25,2.474) B12(-3.05,2.474)

## Nets
As in the schematic, except:
GND: BACK.3 BACK.4 BOOT1.2 C2.1 C3.2 C5.2 C6.2 C7.1 C13.1 C14.1 C15.1 C16.1 C25.2 C33.2 C38.2 C39.2 C55.1 C56.2 C57.2 C58.1 C59.1 C60.1 C61.1 C62.1 C63.1 C65.2 DPAD_DOWN.3 DPAD_DOWN.4 DPAD_LEFT.3 DPAD_LEFT.4 DPAD_RIGHT.3 DPAD_RIGHT.4 DPAD_UP.3 DPAD_UP.4 FPC4.1 FPC4.6 FPC4.13 FPC4.17 FPC4.22 FPC5.1 FPC5.6 FPC5.22 LB.1 LT.1 NOREF#2.58 OPTION1.4 R2.2 R54.1 RESET1.2 START.3 START.4 STICK-L.1 U1.2 U16.19 U16.57 U17.4 U18.2 USBC2.0 USBC2.1 USBC2.2 USBC2.3 USBC2.A1 USBC2.A12 USBC2.B1 USBC2.B12

Pads without a net: BACK 1; DPAD_DOWN 2; DPAD_LEFT 2; DPAD_RIGHT 1; DPAD_UP 2; FPC4 23 24; FPC5 23 24; LB 3 4; LT 3 4; NOREF 58; NOREF#3 58; NOREF#4 58; OPTION1 2 3; START 1; STICK-L 5 6; U1 4; U16 2 3 4 5 6 24 25; U18 4; USBC2 A8 B8; X1 2 4

## Via types
v1: diameter 0.4, hole 0.3, Top Layer to Bottom Layer, 163 vias

## Routing (per net, layer and track width the routed paths; a pad name or vN(x,y) marks a point on that pad's centre or on a via; arc(x,y) is an arc through that point)
+1V1: length 15.2
  Top Layer w0.15: 19.7,58.88 19.7,58.42 20.35,57.77 U16.23
  Top Layer w0.2: U16.45 19.15,49.31 18.75,48.92 18,48.92 17.8,48.72 17.8,47.87 17.44,47.51 15.27,47.51 14.85,47.93 C7.2 ; U16.50 21.15,48.3 v1(21.2,48.25) 21.2,48.13 C58.2
  Bottom Layer w0.2: v1(19.75,51.12) 19.75,49.7 v1(21.2,48.25)
+3.3V: length 101.5
  Top Layer w0.15: 20.84,58.88 20.78,58.81 20.45,58.81 20.35,58.72 20.35,58.22 20.75,57.81 U16.22
  Top Layer w0.2: C59.2 20.72,47.48 20.72,50.09 ; 17.06,44.2 15.99,44.2 14.94,43.15 14.94,42.35 v1(14.74,42.15) 14.74,40.76 STICK-L.3 ; FPC5.18 FPC5.19 ; 17.4,54.62 15.79,54.62 15.59,54.81 ; R52.1 v1(17.65,58.31) ; U16.1 25.36,50.15 26.2,50.15 ; v1(12.84,42.45) 12.53,42.76 C33.1 ; 26.21,54.61 24.51,54.61 24.5,54.62
  Top Layer w0.5: v1(9.74,63.25) 10.99,63.25 11.04,63.3 ; v1(17.3,46.5) 16.19,46.5 14.1,44.41 v1(13.04,44.41) U18.5 11.87,44.28 C33.1 ; v1(23.2,43.5) 22.9,43.8 C55.2 22.15,44.69 R53.2 ; U17.8 27.85,42.34 v1(25.05,45.15)
  Bottom Layer w0.2: v1(23.25,56.02) 18.53,56.02 17.65,56.9 v1(17.65,58.31) ; v1(14.74,42.15) 14.74,40.95 14.54,40.75 13.84,40.75 13.64,40.95 13.64,41.95 13.14,42.45 v1(12.84,42.45)
  Bottom Layer w0.5: 21.95,45.45 21.95,47.22 ; 21.95,45.45 21.65,45.15 21.65,43.95 22,43.6 23.1,43.6 v1(23.2,43.5) ; 21.95,45.45 24.75,45.45 v1(25.05,45.15) ; 21.95,47.22 20.88,46.15 17.65,46.15 v1(17.3,46.5) ; 21.95,47.22 23.3,48.57 v1(23.3,51.2) 22.65,51.85 19.18,51.85 v1(18.55,51.22) ; v1(13.04,44.41) 7.3,44.41 6.54,43.65 5.04,43.65 4.54,44.15 4.54,46.65 4.74,46.85 4.74,53.15 6.34,54.75 6.34,60.25 9.34,63.25 v1(9.74,63.25)
+5V: length 101.6
  Top Layer w0.2: 11.04,64.05 FPC5.21
  Top Layer w0.239: FPC4.21 FPC4.19 FPC4.18
  Top Layer w0.5: 11.04,64.28 11.01,64.25 v1(8.44,64.25) ; 24.93,12.92 24.93,12.12 24.61,11.8 v1(24,11.8) 23.35,11.8 23.03,12.12 23.03,12.92 ; v1(2.6,10.9) 1.3,12.2 v1(1.3,31.68) ; v1(3.61,43.82) 7.64,47.85 8.45,47.85 9.2,48.6 9.2,48.9 C25.1 11.1,49.6 11.1,48.73 12.01,47.82 U18.1
  Bottom Layer w0.5: v1(8.44,64.25) 5.64,61.45 5.64,55.05 4.04,53.45 4.04,52.55 2.64,51.15 2.64,44.79 v1(3.61,43.82) 3.61,33.99 v1(1.3,31.68) ; v1(24,11.8) 17.2,11.8 16.3,10.9 v1(2.6,10.9)
GND: length 6.8
  Top Layer w0.15: U16.19 21.95,57.95 22.9,58.9 v1(24.7,58.9)
  Top Layer w0.2: C56.2 14.9,49.34 C7.1 17.14,48.3 C14.1
  vias: v1(0.6,10.05) v1(1.6,4.05) v1(3.6,54.75) v1(3.7,48.2) v1(3.8,60.35) v1(3.9,64.35) v1(4.4,43.05) v1(4.4,34.45) v1(4.6,40.45) v1(4.6,1.75) v1(4.84,6.05) v1(5.2,71.06) v1(6,44.35) v1(6.5,40.75) v1(6.6,38.15) v1(6.6,9.1) v1(7.15,3.7) v1(7.24,49.35) v1(7.4,51.45) v1(7.5,64.75) v1(8.1,60.05) v1(8.84,46.35) v1(9,43.65) v1(9.3,42.45) v1(10.84,54.05) v1(11.01,45.6) v1(11.5,53.95) v1(12,51.25) v1(12.1,57.65) v1(12.7,64.95) v1(12.85,58.45) v1(12.97,61.48) v1(13.14,55.55) v1(13.6,49.75) v1(15,57.85) v1(15,54) v1(15.02,4.41) v1(15.8,63.75) v1(15.87,42.14) v1(16.4,12.85) v1(16.52,41.04) v1(17.05,58.25) v1(17.29,65.03) v1(17.7,43.29) v1(18.5,61.85) v1(18.55,55.5) v1(19.4,61.55) v1(19.55,55.5) v1(19.6,45.45) v1(19.8,70.25) v1(19.9,12.85) v1(20.4,41.9) v1(20.7,62.45) v1(21.7,65.25) v1(21.9,42.45) v1(22.04,10.91) v1(23,59.65) v1(24.09,13.88) v1(24.3,62.75) v1(24.64,46.25) v1(25.3,36.95) v1(25.3,5.35) v1(25.52,51.71) v1(25.65,57) v1(26.03,65.25) v1(26.3,69.15) v1(26.9,8.95) v1(26.94,53.05) v1(27.5,56.55) v1(27.5,49.2) v1(28.1,35.65) v1(28.1,32.55) v1(28.1,29.68) v1(28.1,27.25) v1(28.1,24.87) v1(28.1,21.55) v1(28.1,17.07) v1(28.2,44.25) v1(28.4,60.55) v1(28.4,53.35)
VBUS: length 14.3
  Top Layer w0.2: C6.1 18.43,10.29 R43.2 ; C5.1 13.53,10.16 R44.2
  Bottom Layer w0.7: 19.15,8.3 18.65,7.8 11.65,7.8 11.2,8.25 v1(11.2,8.75)
  vias: v1(19.1,8.3)
(no net):
  vias: v1(12.7,40.85)
A1: length 14.8
  Top Layer w0.15: U16.17 22.75,57.81 23.13,58.2 24.3,58.2 v1(25,57.5)
  Bottom Layer w0.239: 26.25,62.47 25.38,63.35 22.9,63.35 22.6,63.05 22.6,61.15 24.3,59.45 25,59.45 25.4,59.05 25.4,57.9 v1(25,57.5)
A2: length 9.6
  Top Layer w0.15: v1(12.8,57.65) 12.2,58.25 12.2,60.15 11.8,60.55 FPC5.13 ; v1(15.3,56.55) 15.45,56.55 16.59,55.42 U16.31
  Bottom Layer w0.15: v1(15.3,56.55) 14.2,57.65 v1(12.8,57.65)
BCK: length 19.8
  Top Layer w0.15: v1(6.54,45.85) 7.64,45.85 ; FPC5.14 8.24,61.05 6.9,59.71 v1(6.9,54.35)
  Bottom Layer w0.15: v1(6.9,54.35) 6.9,50.91 6.54,50.55 v1(6.54,45.85)
DIN: length 23.1
  Top Layer w0.15: v1(5.9,53.05) 5.9,60.11 7.84,62.05 FPC5.16 ; FPC4.14 v1(6.54,44.85)
  Bottom Layer w0.15: v1(6.54,44.85) 5.94,44.85 5.64,45.15 5.64,50.45 5.9,50.71 v1(5.9,53.05)
DOWN: length 31.8
  Top Layer w0.15: U16.29 16.45,57.16 12.55,57.16 v1(12.44,57.05)
  Bottom Layer w0.15: 19.28,47.25 16.4,47.25 16.2,47.05 14.5,47.05 13.7,46.25 9.8,46.25 9.3,46.75 9.3,51.25 7.5,53.05 7.5,55.25 7.3,55.45 7.3,56.3 7.45,56.45 11.84,56.45 v1(12.44,57.05)
J1-X: length 16.9
  Top Layer w0.15: v1(14.24,45.55) 12.54,47.25 12.54,51.74 13.1,52.3 13.93,52.3 14.25,52.62 U16.38
  Top Layer w0.2: STICK-L.4 v1(14.25,41.7)
  Bottom Layer w0.2: v1(14.25,41.7) 14.25,45.54 v1(14.24,45.55)
J1-Y: length 16.5
  Top Layer w0.15: v1(14.94,46.15) 14.94,46.96 13.1,48.8 13.1,51.47 13.33,51.7 13.83,51.7 14.35,52.22 U16.39
  Top Layer w0.2: STICK-L.2 15.25,42.45 v1(15.6,42.8)
  Bottom Layer w0.2: v1(15.6,42.8) 15.6,45.49 v1(14.94,46.15)
J2-X: length 10
  Top Layer w0.15: v1(13.6,51.1) 13.73,51.1 14.45,51.81 U16.40
  Top Layer w0.2: v1(12.8,54.8) 12.55,55.05 FPC5.2
  Bottom Layer w0.2: v1(12.8,54.8) 12.8,51.9 v1(13.6,51.1)
J2-Y: length 11.5
  Top Layer w0.15: v1(13.9,50.3) 13.9,50.77 14.55,51.42 U16.41
  Top Layer w0.2: FPC5.3 12.25,55.55 v1(12.3,55.5)
  Bottom Layer w0.2: v1(13.9,50.3) 13.7,50.3 12.3,51.7 v1(12.3,55.5)
K1: length 32.1
  Top Layer w0.15: v1(26.05,55.42) 25.85,55.42 25.45,55.02 U16.11 ; v1(8.84,54.85) 8.84,58.05 9.84,59.05 FPC5.10
  Bottom Layer w0.15: v1(26.05,55.42) 25.34,54.7 ; 25.34,54.7 23.98,53.35 18.61,53.35 15.44,50.18 15.44,49.68 14.26,48.5 12.65,48.5 10.2,50.95 10.2,51.75 8.84,53.11 v1(8.84,54.85) ; 25.34,54.7 25.34,54.65
K2: length 32.9
  Top Layer w0.15: v1(26.1,53.75) 26.05,53.75 25.58,54.22 U16.9 ; FPC5.11 9.74,59.55 8.3,58.11 v1(8.3,55.45)
  Bottom Layer w0.15: v1(8.3,55.45) 8.3,53.15 9.9,51.55 9.9,50.85 12.5,48.25 14.38,48.25 15.74,49.61 15.74,50.07 18.72,53.05 24.04,53.05 24.74,53.75 v1(26.1,53.75)
K3: length 36.8
  Top Layer w0.15: v1(7.8,55.95) 7.8,58.31 9.54,60.05 FPC5.12 ; v1(26.85,52.35) 25.38,53.81 U16.8
  Bottom Layer w0.15: v1(26.85,52.35) 26.25,52.95 24.74,52.95 24.54,52.75 18.81,52.75 16.04,49.97 16.04,48.45 15.54,47.95 12.4,47.95 9.6,50.75 9.6,51.35 7.8,53.15 v1(7.8,55.95)
K4: length 39.6
  Top Layer w0.15: v1(28,57) 28.5,56.5 28.5,54.35 27.42,53.27 27.42,52.32 26.9,51.8 26.3,51.8 25.6,52.5 25.6,52.96 25.15,53.42 U16.7
  Top Layer w0.2: LT.2 11.25,71.6 12.15,72.5 21.3,72.5 22.04,71.76 22.04,67.33 23,66.37 23,62.65 v1(23.1,62.55)
  Bottom Layer w0.2: v1(23.1,62.55) 23.1,61.5 24.7,59.9 26.6,59.9 28,58.5 v1(28,57)
L3: length 7
  Top Layer w0.15: U16.32 16.49,55.02 15.95,55.55 15.4,55.55 v1(15.2,55.75) ; FPC5.5 12.75,56.55 v1(12.8,56.6)
  Bottom Layer w0.15: v1(15.2,55.75) 15.15,55.75 14.3,56.6 v1(12.8,56.6)
LEFT: length 20.3
  Top Layer w0.15: v1(13.3,60) 14.46,60 15.75,58.72 15.75,58.5 16.44,57.81 17.95,57.81 18.15,58.02 18.52,58.02 18.75,57.79 U16.27
  Top Layer w0.2: v1(20.9,61.2) 18.87,63.23 v1(16.53,63.23)
  Bottom Layer w0.2: 21.75,58.28 20.9,59.12 v1(20.9,61.2) ; v1(13.3,60) v1(16.53,63.23)
LRCK: length 21.6
  Top Layer w0.15: v1(6.4,53.75) 6.4,59.91 8.04,61.55 FPC5.15 ; v1(6.14,45.35) FPC4.15
  Bottom Layer w0.15: v1(6.14,45.35) 6.04,45.45 6.04,50.45 6.4,50.81 v1(6.4,53.75)
P1: length 27.2
  Top Layer w0.15: v1(10.94,53.25) 10.14,54.05 10.14,57.35 10.34,57.55 FPC5.7 ; U16.15 23.81,56.9 v1(24.7,56.9)
  Bottom Layer w0.15: v1(24.7,56.9) 24.7,55.81 23.14,54.25 18.25,54.25 14.54,50.53 14.54,49.98 13.88,49.32 13.03,49.32 11.4,50.95 11.4,52.78 v1(10.94,53.25)
P2: length 28.2
  Top Layer w0.15: U16.14 24.95,56.22 v1(25.25,56.52) ; FPC5.8 10.24,58.05 9.8,57.61 v1(9.8,53.55)
  Bottom Layer w0.15: v1(9.8,53.55) 10.8,52.55 10.8,51.15 12.9,49.05 13.96,49.05 14.84,49.93 14.84,50.43 18.35,53.95 23.24,53.95 25.25,55.96 v1(25.25,56.52)
P3: length 38.3
  Top Layer w0.15: v1(9.34,54.35) 9.34,57.95 9.94,58.55 FPC5.9 ; v1(26.6,56.35) 25.69,56.35 25.15,55.81 U16.13
  Bottom Layer w0.15: v1(9.34,54.35) 9.34,53.21 10.5,52.05 10.5,51.05 12.75,48.8 14.1,48.8 15.14,49.83 15.14,50.28 18.51,53.65 23.43,53.65 26.13,56.35 v1(26.6,56.35) 27.64,55.31 27.64,52.45 27.04,51.85 26.74,51.85 26.24,52.35
P4: length 22.7
  Top Layer w0.15: v1(28,56) 27.41,55.42 26.75,55.42 26.26,55.9 25.83,55.9 25.35,55.42 U16.12
  Top Layer w0.2: LB.2 23.1,71.1 23.1,67.37 23.6,66.87 v1(23.6,62.15)
  Bottom Layer w0.2: v1(28,56) 28.5,56.5 28.5,58.7 26.8,60.4 25.35,60.4 v1(23.6,62.15)
PWR_BUTTON: length 27.4
  Top Layer w0.15: v1(5.24,44.48) 5.24,42.35 6.24,41.35 FPC4.7 ; v1(5.4,52.35) 5.4,60.31 7.64,62.55 FPC5.17
  Bottom Layer w0.15: v1(5.24,44.48) 5.24,50.65 5.4,50.81 v1(5.4,52.35)
QSPI_SCLK: length 11.6
  Top Layer w0.2: v1(24.4,44) 25.31,43.09 U17.6 ; U16.52 21.95,49.15 23.05,48.05 23.05,45.71 23.4,45.36 v1(23.4,44.2)
  Bottom Layer w0.2: v1(23.4,44.2) 24.2,44.2 v1(24.4,44)
QSPI_SD0: length 10.7
  Top Layer w0.2: U16.53 22.35,49.25 23.45,48.15 23.45,45.95 23.9,45.5 23.9,42.5 24.04,42.35 24.04,40.02
QSPI_SD1: length 5.5
  Top Layer w0.2: U16.55 23.15,49.45 23.35,49.25 25.15,49.25 26.58,47.81 26.58,47.08
QSPI_SD2: length 4.6
  Top Layer w0.2: U17.3 25.31,48.18 24.65,48.85 23.25,48.85 22.75,49.35 U16.54
QSPI_SD3: length 12.7
  Top Layer w0.2: v1(24.8,44.4) 26.58,42.62 26.58,40.32 ; U16.51 21.55,49.05 22.65,47.95 22.65,45.05 v1(22.9,44.8)
  Bottom Layer w0.2: v1(22.9,44.8) 24.4,44.8 v1(24.8,44.4)
QSPI_SS: length 18.6
  Top Layer w0.15: v1(20.26,45) 19.97,45 R51.2
  Top Layer w0.2: U17.1 27.85,47.94 26.45,49.35 25.59,49.35 24.87,50.06 U16.56 ; R53.1 v1(20.26,45)
  Top Layer w0.254: v1(26.2,45.1) 26.8,45.1 27.85,46.15 U17.1
  Bottom Layer w0.254: 26.2,45.1 24.05,42.95 21.71,42.95 20.26,44.39 v1(20.26,45)
R3: length 7.4
  Top Layer w0.15: v1(12.4,56.1) 12.35,56.05 FPC5.4
  Top Layer w0.2: U16.34 16.72,54.22 16.4,53.9 v1(16.4,53.9)
  Bottom Layer w0.15: v1(12.4,56.1) 14.2,56.1 v1(16.4,53.9)
RIGHT: length 11.5
  Top Layer w0.15: v1(13.3,59.3) 14.66,59.3 15.35,58.62 15.35,58.4 16.34,57.42 17.45,57.42 17.55,57.31 18.2,57.31 U16.28
  Bottom Layer w0.2: v1(13.3,59.3) 9.28,59.3 8.25,58.28
S1: length 74.8
  Top Layer w0.15: U16.18 22.35,57.85 23,58.5 24.44,58.5 24.69,58.25 v1(24.9,58.25)
  Top Layer w0.2: v1(2.14,43.45) 2.14,43.74 6.2,47.8 6.2,49.8 6.9,50.5 8.9,50.5 9.9,51.5 10.3,51.5 13,54.2 v1(13.3,54.2) ; v1(1,33.5) 0.4,32.9 0.4,11.4 v1(0.8,11)
  Bottom Layer w0.15: v1(24.9,58.25) 24.88,58.28 23.88,58.28 23.6,58 23.6,56.6 23.9,56.3 23.9,56 22.8,54.9 17.53,54.9 17.53,54.33 16.6,53.4 14.1,53.4 v1(13.3,54.2)
  Bottom Layer w0.2: v1(1,33.5) 2.44,34.93 2.44,42.75 2.14,43.05 v1(2.14,43.45) ; 4.72,9.05 2.75,9.05 v1(0.8,11)
S2: length 81.6
  Top Layer w0.15: v1(24.1,57.7) 23.86,57.94 23.34,57.94 23.15,57.75 U16.16
  Top Layer w0.2: v1(13.3,53.5) 13,53.5 10.6,51.1 10.1,51.1 9.1,50.1 7.1,50.1 6.6,49.6 6.6,47.6 2.74,43.74 v1(2.74,43.35) ; v1(1.5,32.9) 0.8,32.2 0.8,11.8 v1(1.6,11)
  Bottom Layer w0.15: v1(24.1,57.7) 24.1,56.6 24.3,56.4 24.3,55.9 23,54.6 18.2,54.6 16.7,53.1 13.7,53.1 v1(13.3,53.5)
  Bottom Layer w0.2: 1.57,32.95 2.94,34.32 2.94,43.15 v1(2.74,43.35) ; v1(1.6,11) 2.5,10.1 15.68,10.1 16.72,9.05
UP: length 11.5
  Top Layer w0.15: U16.30 16.81,55.81 16.35,56.28 16.35,56.49 16.2,56.64 v1(16.2,56.65)
  Bottom Layer w0.2: v1(16.2,56.65) 16.2,57.2 16.5,57.5 16.5,59 17.5,60 17.5,63.48 19.28,65.25
USB2_N: length 16
  Top Layer w0.239: R48.2 18.47,46.62 18.85,46.25 18.85,46.13 17.96,45.24 17.72,45.48 17.72,45.61 17.48,45.84 16.96,45.84 16.72,45.61 16.72,45.48 16.48,45.24 15.78,45.24 14.2,43.66 14.2,42.9 13.2,41.9 9.95,41.9 8.4,40.35 FPC4.5
USB2_P: length 16
  Top Layer w0.239: FPC4.4 8.41,39.85 8.55,39.99 8.56,39.96 10.11,41.51 13.36,41.51 14.59,42.74 14.59,43.5 15.94,44.85 18.12,44.85 19.24,45.97 19.24,46.25 19.61,46.62 R47.1
USB3-0-D_N: length 52.5
  Top Layer w0.239: 15.3,8.95 14.81,8.95 14.27,8.42 USBC2.B7 ; 15.3,8.95 15.3,10.85 14.24,11.91 2.64,11.91 2.1,12.45 2.1,38.25 3.14,39.29 6.81,39.29 6.87,39.35 FPC4.3 ; 15.3,8.95 15.3,6.89 USBC2.A7
USB3-0-D_P: length 52.4
  Top Layer w0.239: USBC2.A6 14.8,6.82 14.8,6.06 15.01,5.85 15.53,5.85 15.77,6.08 USBC2.B6 15.77,10.93 14.4,12.3 8.76,12.3 8.51,12.55 7.71,12.55 7.46,12.3 6.76,12.3 6.46,12.6 5.76,12.6 5.46,12.3 4.76,12.3 4.46,12.6 3.76,12.6 3.46,12.3 2.84,12.3 2.49,12.65 2.49,38.09 3.3,38.9 6.81,38.9 6.87,38.85 FPC4.2
XIN: length 10.2
  Top Layer w0.15: U16.20 21.55,58.42 21.95,58.81 22.41,58.81 22.75,59.15 24,59.15 24.6,59.75 24.6,60 25,60.4 26.47,60.4 X1.1 27.55,59.33 C2.2
XOUT: length 2.9
  Top Layer w0.15: 22.25,59.28 21.62,59.28 21.44,59.11 21.44,58.69 21.15,58.4 U16.21
$1N5125: length 2.6
  Top Layer w0.2: USBC2.B5 16.77,9.4 R43.1
$1N5126: length 2.6
  Top Layer w0.2: R44.1 13.6,9.07 13.77,8.9 USBC2.A5
$1N5147: length 3.6
  Top Layer w0.2: R2.1 21.59,11.94 22.4,11.94 23.18,11.17 23.68,11.17 23.98,10.87 23.98,10.22
$1N5203: length 1.4
  Top Layer w0.2: LED3.1 14.43,55.23 R54.2
$1N5210: length 4.2
  Top Layer w0.15: R49.1 24.09,60.25 24.5,60.66 24.78,60.66 X1.3
$1N5217: length 3.9
  Top Layer w0.254: 22.49,41.4 22.17,41.4 19.6,43.97
$1N5218: length 5.7
  Top Layer w0.2: R52.2 17.65,60.68 ; 17.65,60.68 R50.2 ; 17.65,60.68 19.15,59.18 U16.26
$1N5219: length 3.4
  Top Layer w0.2: LED3.2 14.39,53.02 U16.37
$1N5220: length 2.6
  Top Layer w0.239: R47.2 19.32,48.1 19.24,48.18 19.24,48.3 19.94,49.01 19.94,49.39 19.95,49.4 U16.47
$1N5221: length 6.1
  Top Layer w0.2: R50.1 16.68,62.15 16.25,61.72 16.25,60.16 ; 16.25,60.16 C63.2 ; 16.25,60.16 13.95,62.46 RESET1.1
$1N5239: length 2.6
  Top Layer w0.239: R48.1 18.76,48.1 18.85,48.18 18.85,48.46 19.55,49.17 19.55,49.39 19.55,49.4 U16.46
$1N5319: length 2
  Top Layer w0.2: R55.2 10.11,48.35 U18.3

## Copper pours and planes (outline as drawn; the poured copper is in the pictures)
+1V1 on Top Layer: 20.55,57.72 20.15,57.72 20.15,55.62 20.55,55.22 22.55,55.22 22.55,52.02 19.35,52.02 19.05,51.72 19.05,49.52 19.25,49.52 19.25,50.62 19.35,50.72 20.05,50.72 20.15,50.81 20.15,51.12 20.45,51.42 22.75,51.42 23.15,51.81 23.15,55.42 22.65,55.92 20.85,55.92 20.55,56.22
+3.3V on Top Layer: 20.62,57.72 20.62,56.22 20.89,55.95 22.79,55.95 23.22,55.52 23.22,51.81 22.72,51.31 20.42,51.31 20.22,51.12 20.22,49.52 20.82,49.52 20.82,50.62 20.92,50.72 25.02,50.72 25.02,51.12 23.92,51.12 23.82,51.22 23.82,54.42 23.92,54.52 25.02,54.52 25.02,54.72 23.92,54.72 23.82,54.81 23.82,56.12 23.42,56.52 20.92,56.52 20.92,57.72
+3.3V on Top Layer: 18.65,54.72 19.3,54.06 19.3,50.52 18.9,50.52 18.9,49.35 18.54,49 15.55,49 15.55,51.08 15.68,51.21 18.05,51.21 18.05,54.31 17.85,54.52 16.85,54.52 16.85,54.72
+5V on Top Layer: 24.47,11.68 24.47,13.48 24.68,13.68 27.47,13.68 27.83,13.33 27.83,11.83 27.68,11.68
GND on Top Layer: -5.9,78.05 33.8,78.05 33.8,-3.95 -5.9,-3.95
GND on Top Layer: 19.35,54.06 19.35,52.02 22.55,52.02 22.55,55.22 20.35,55.22 20.05,55.52 20.05,56.52 18.06,56.52 18.06,54.81
GND on Bottom Layer: -15.8,81.15 38.4,81.15 38.4,-6.05 -15.8,-6.05
GND on Inner1: -17.7,81.75 35.9,81.75 35.9,-9.45 -17.7,-9.45
GND on Inner2: -18.9,84.55 40.3,84.55 40.3,-9.65 -18.9,-9.65
VBUS on Top Layer: 25.23,10.82 25.23,8.22 23.88,6.87 20.78,6.87 19.78,7.87 17.79,7.87 17.79,6.17 17.08,6.17 17.08,8.77 17.5,9.19 17.5,11.13 17.65,11.28 19.22,11.28 19.46,11.04 19.46,9.38 19.58,9.27 23.98,9.27 24.48,9.77 24.48,10.87 25.18,10.87
VBUS on Top Layer: 12.98,6.17 12.98,8.97 12.28,9.67 11.08,9.67 11.08,10.87 10.88,11.07 9.52,11.07 9.18,10.72 9.18,9.47 8.78,9.07 7.68,9.07 6.98,8.37 6.98,5.97 7.28,5.67 9.28,5.67 9.98,6.37 9.98,7.1 11.15,8.27 12.31,8.27 12.31,6.17

## Text on the board
Top Silkscreen Layer: https://github.com/borpendy/DSpi3 | R
